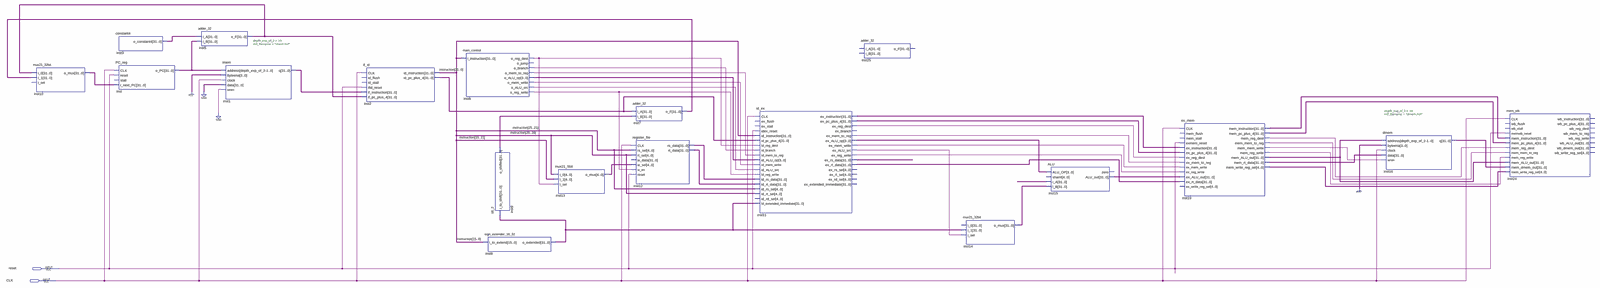
[diagram p0: schematic sheet, whole]
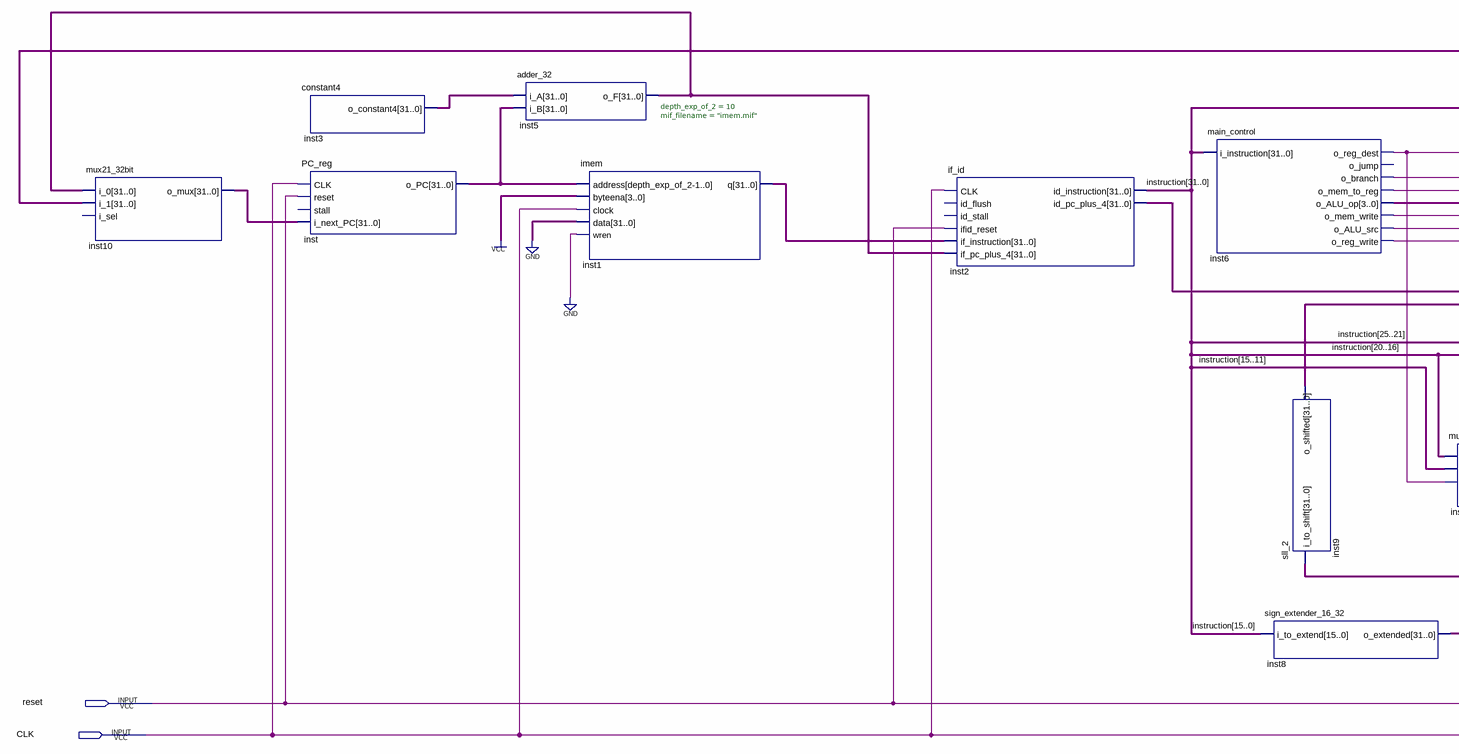
[diagram p1: schematic sheet, left part]
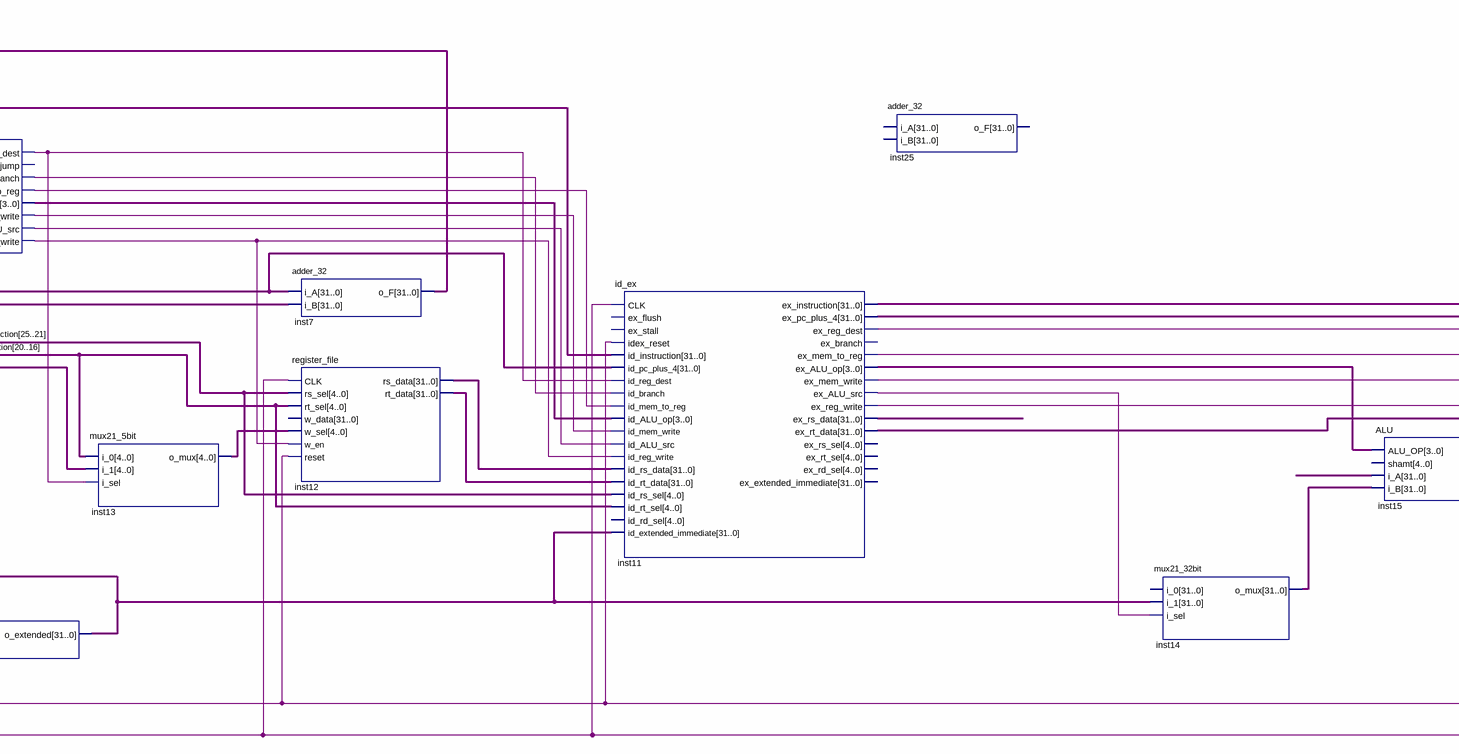
[diagram p2: schematic sheet, centre part]
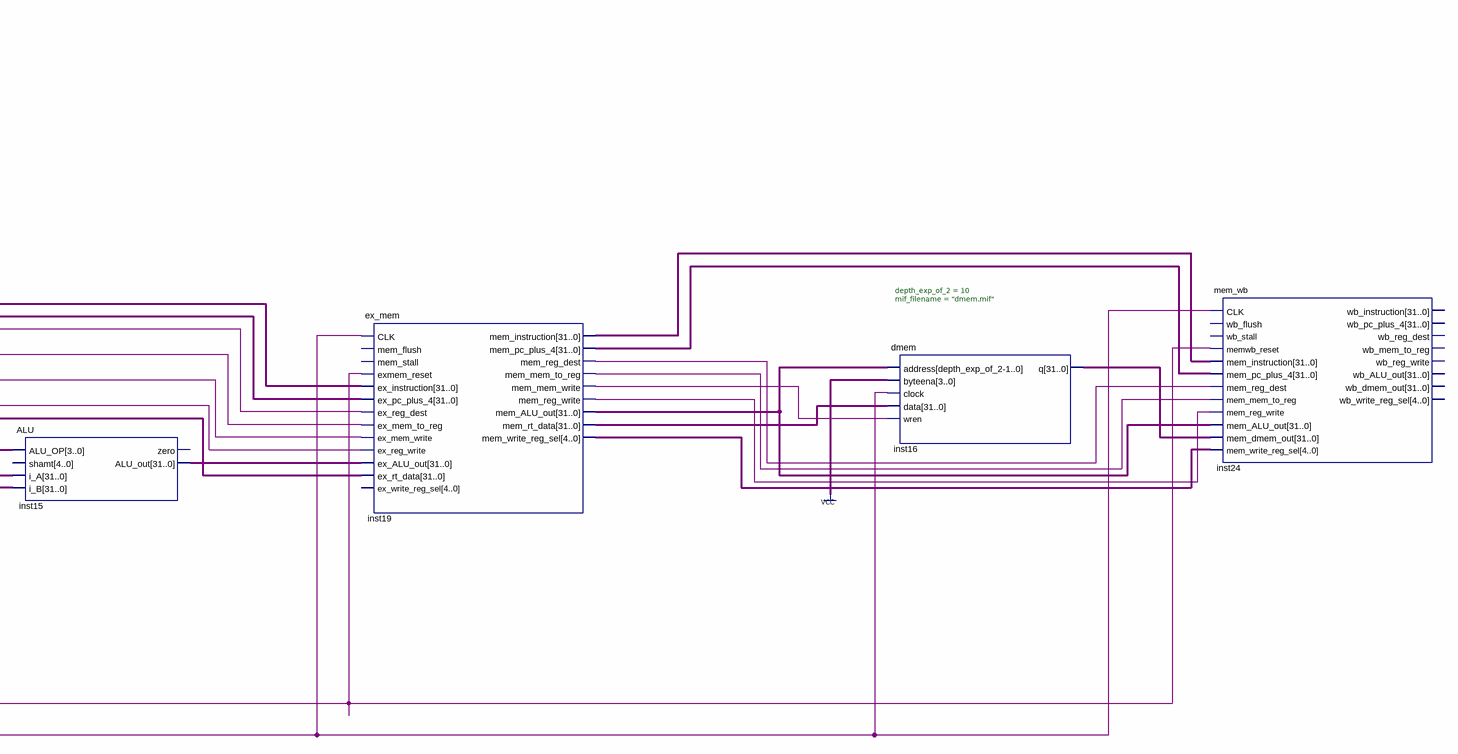
[diagram p3: schematic sheet, right part]
// Quartus schematic Block1.bdf as structural Verilog: 19 symbols, 2 pins
module Block1 (
  input  reset,
  input  CLK
);

  wire inst6_o_alu_src, inst6_o_branch, inst6_o_mem_to_reg, inst6_o_mem_write, inst6_o_reg_dest,
       inst6_o_reg_write, inst11_ex_alu_src, inst11_ex_mem_to_reg, inst11_ex_mem_write, inst11_ex_reg_dest,
       inst11_ex_reg_write, inst19_mem_mem_to_reg, inst19_mem_mem_write, inst19_mem_reg_dest,
       inst19_mem_reg_write;
  wire [3:0] inst6_o_alu_op, inst11_ex_alu_op;
  wire [4:0] inst13_o_mux, inst19_mem_write_reg_sel;
  wire [31:0] inst1_q, inst2_id_pc_plus_4, inst3_o_constant4, inst5_o_f, inst7_o_f, inst8_o_extended,
       inst9_o_shifted, inst10_o_mux, inst11_ex_instruction, inst11_ex_pc_plus_4, inst11_ex_rs_data,
       inst11_ex_rt_data, inst12_rs_data, inst12_rt_data, inst14_o_mux, inst15_alu_out, inst16_q,
       inst19_mem_alu_out, inst19_mem_instruction, inst19_mem_pc_plus_4, inst19_mem_rt_data, inst_o_pc,
       instruction, undriven;

  mux21_32bit inst10 (.i_0(inst5_o_f), .i_1(inst7_o_f), .o_mux(inst10_o_mux));  // open: i_sel
  constant4 inst3 (.o_constant4(inst3_o_constant4));
  PC_reg inst (.CLK(CLK), .reset(reset), .i_next_PC(inst10_o_mux), .o_PC(inst_o_pc));  // open: stall
  adder_32 inst5 (.i_A(inst3_o_constant4), .i_B(inst_o_pc), .o_F(inst5_o_f));
  imem #(.depth_exp_of_2(10), .mif_filename("imem.mif")) inst1 (
    .address(inst_o_pc), .byteena(4'b1111), .clock(CLK), .data({32{1'b0}}), .wren(1'b0), .q(inst1_q));
  if_id inst2 (
    .CLK(CLK), .ifid_reset(reset), .if_instruction(inst1_q), .if_pc_plus_4(inst5_o_f),
    .id_instruction(instruction), .id_pc_plus_4(inst2_id_pc_plus_4));  // open: id_flush, id_stall
  main_control inst6 (
    .i_instruction(instruction), .o_reg_dest(inst6_o_reg_dest), .o_branch(inst6_o_branch),
    .o_mem_to_reg(inst6_o_mem_to_reg), .o_ALU_op(inst6_o_alu_op), .o_mem_write(inst6_o_mem_write),
    .o_ALU_src(inst6_o_alu_src), .o_reg_write(inst6_o_reg_write));  // open: o_jump
  sll_2 inst9 (.i_to_shift(inst8_o_extended), .o_shifted(inst9_o_shifted));
  sign_extender_16_32 inst8 (.i_to_extend(instruction[15:0]), .o_extended(inst8_o_extended));
  mux21_5bit inst13 (
    .i_0(instruction[20:16]), .i_1(instruction[15:11]), .i_sel(inst6_o_reg_dest), .o_mux(inst13_o_mux));
  adder_32 inst7 (.i_A(inst2_id_pc_plus_4), .i_B(inst9_o_shifted), .o_F(inst7_o_f));
  register_file inst12 (
    .CLK(CLK), .rs_sel(instruction[25:21]), .rt_sel(instruction[20:16]), .w_sel(inst13_o_mux),
    .w_en(inst6_o_reg_write), .reset(reset), .rs_data(inst12_rs_data), .rt_data(inst12_rt_data));  // open: w_data
  id_ex inst11 (
    .CLK(CLK), .idex_reset(reset), .id_instruction(instruction), .id_pc_plus_4(inst2_id_pc_plus_4),
    .id_reg_dest(inst6_o_reg_dest), .id_branch(inst6_o_branch), .id_mem_to_reg(inst6_o_mem_to_reg),
    .id_ALU_op(inst6_o_alu_op), .id_mem_write(inst6_o_mem_write), .id_ALU_src(inst6_o_alu_src),
    .id_reg_write(inst6_o_reg_write), .id_rs_data(inst12_rs_data), .id_rt_data(inst12_rt_data),
    .id_rs_sel(instruction[25:21]), .id_rt_sel(instruction[20:16]), .id_extended_immediate(inst8_o_extended),
    .ex_instruction(inst11_ex_instruction), .ex_pc_plus_4(inst11_ex_pc_plus_4),
    .ex_reg_dest(inst11_ex_reg_dest), .ex_mem_to_reg(inst11_ex_mem_to_reg), .ex_ALU_op(inst11_ex_alu_op),
    .ex_mem_write(inst11_ex_mem_write), .ex_ALU_src(inst11_ex_alu_src), .ex_reg_write(inst11_ex_reg_write),
    .ex_rs_data(inst11_ex_rs_data), .ex_rt_data(inst11_ex_rt_data));  // open: ex_flush, ex_stall, id_rd_sel, ex_branch, ex_rs_sel, ex_rt_sel, ex_rd_sel, ex_extended_immediate
  adder_32 inst25 ();  // open: i_A, i_B, o_F
  mux21_32bit inst14 (.i_1(inst8_o_extended), .i_sel(inst11_ex_alu_src), .o_mux(inst14_o_mux));  // open: i_0
  ALU inst15 (
    .ALU_OP(inst11_ex_alu_op), .i_A(undriven), .i_B(inst14_o_mux), .ALU_out(inst15_alu_out));  // open: shamt, zero
  ex_mem inst19 (
    .CLK(CLK), .exmem_reset(reset), .ex_instruction(inst11_ex_instruction),
    .ex_pc_plus_4(inst11_ex_pc_plus_4), .ex_reg_dest(inst11_ex_reg_dest),
    .ex_mem_to_reg(inst11_ex_mem_to_reg), .ex_mem_write(inst11_ex_mem_write),
    .ex_reg_write(inst11_ex_reg_write), .ex_ALU_out(inst15_alu_out), .ex_rt_data(inst11_ex_rt_data),
    .mem_instruction(inst19_mem_instruction), .mem_pc_plus_4(inst19_mem_pc_plus_4),
    .mem_reg_dest(inst19_mem_reg_dest), .mem_mem_to_reg(inst19_mem_mem_to_reg),
    .mem_mem_write(inst19_mem_mem_write), .mem_reg_write(inst19_mem_reg_write),
    .mem_ALU_out(inst19_mem_alu_out), .mem_rt_data(inst19_mem_rt_data),
    .mem_write_reg_sel(inst19_mem_write_reg_sel));  // open: mem_flush, mem_stall, ex_write_reg_sel
  dmem #(.depth_exp_of_2(10), .mif_filename("dmem.mif")) inst16 (
    .address(inst19_mem_alu_out), .byteena(4'b1111), .clock(CLK), .data(inst19_mem_rt_data),
    .wren(inst19_mem_mem_write), .q(inst16_q));
  mem_wb inst24 (
    .CLK(CLK), .memwb_reset(reset), .mem_instruction(inst19_mem_instruction),
    .mem_pc_plus_4(inst19_mem_pc_plus_4), .mem_reg_dest(inst19_mem_reg_dest),
    .mem_mem_to_reg(inst19_mem_mem_to_reg), .mem_reg_write(inst19_mem_reg_write),
    .mem_ALU_out(inst19_mem_alu_out), .mem_dmem_out(inst16_q), .mem_write_reg_sel(inst19_mem_write_reg_sel));  // open: wb_flush, wb_stall, wb_instruction, wb_pc_plus_4, wb_reg_dest, wb_mem_to_reg, wb_reg_write, wb_ALU_out, wb_dmem_out, wb_write_reg_sel
endmodule
